# EAGLE design power (EAGLE 9.1.1)

## Sheet 1 of 2: Power supply denoising
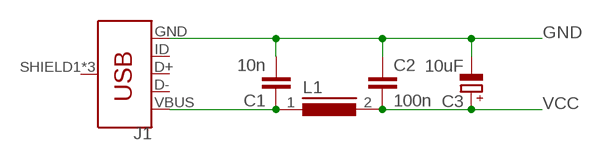
[diagram p0: schematic, sheet 1]

### Parts
C1  10n  C-EU050-024X044  [C050-024X044]
C2  100n  C-EU050-024X044  [C050-024X044]
C3  10uF  CPOL-EUE2.5-5  [E2,5-5]
J1  USB_MICRO-B_FEMALE-SMT  [USB-B-MICRO-SMD]
L1  Ferrite bead  MMICC7  [MMICC7]

### Nets
GND: C1.2 C2.1 C3.- J1.GND ; also sheet 2
VBUS: C1.1 J1.VBUS L1.1
VCC: C2.2 C3.+ L1.2 ; also sheet 2
Unconnected: J1.D+ J1.D- J1.ID J1.SHIELD1(SHIELD) J1.SHIELD2(SHIELD) J1.SHIELD3(SHIELD)

## Sheet 2 of 2: Connectors and op-amp stages
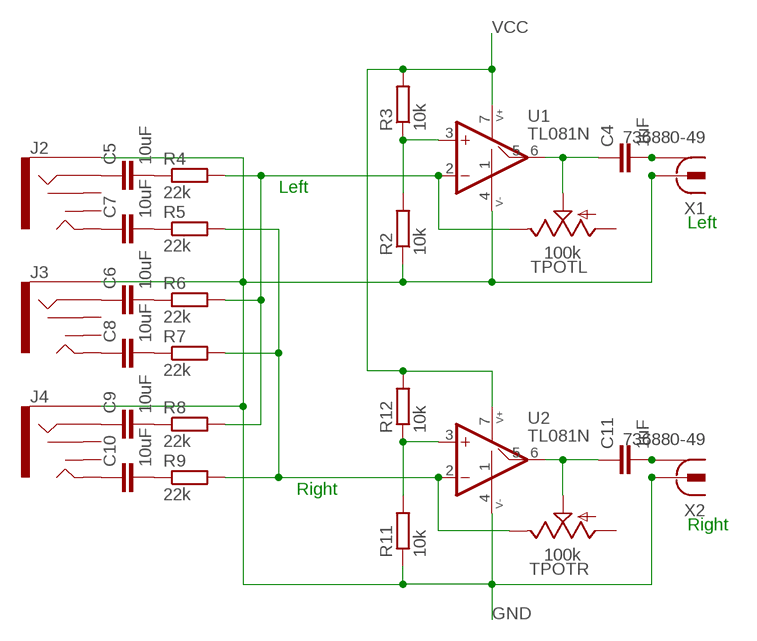
[diagram p1: schematic, sheet 2]

### Parts
C4  1uF  C-EU050-024X044  [C050-024X044]
C5  10uF  C-EU050-024X044  [C050-024X044]
C6  10uF  C-EU050-024X044  [C050-024X044]
C7  10uF  C-EU050-024X044  [C050-024X044]
C8  10uF  C-EU050-024X044  [C050-024X044]
C9  10uF  C-EU050-024X044  [C050-024X044]
C10  10uF  C-EU050-024X044  [C050-024X044]
C11  1uF  C-EU050-024X044  [C050-024X044]
J2  AUDIO_JACK_3.5MM_KIT  [AUDIO-JACK-KIT]
J3  AUDIO_JACK_3.5MM_KIT  [AUDIO-JACK-KIT]
J4  AUDIO_JACK_3.5MM_KIT  [AUDIO-JACK-KIT]
R2  10k  R-EU_0204/5  [0204/5]
R3  10k  R-EU_0204/5  [0204/5]
R4  22k  R-EU_0204/5  [0204/5]
R5  22k  R-EU_0204/5  [0204/5]
R6  22k  R-EU_0204/5  [0204/5]
R7  22k  R-EU_0204/5  [0204/5]
R8  22k  R-EU_0204/5  [0204/5]
R9  22k  R-EU_0204/5  [0204/5]
R11  10k  R-EU_0204/5  [0204/5]
R12  10k  R-EU_0204/5  [0204/5]
TPOTL  100k  TRIM_US-B25P  [B25P]
TPOTR  100k  TRIM_US-B25P  [B25P]
U1  TL081N  [DIL08]
U2  TL081N  [DIL08]
X1  736880-49  [736880-49]
X2  736880-49  [736880-49]

### Nets
GND: J2.SLEEVE J3.SLEEVE J4.SLEEVE R2.1 R11.1 U1.4(P:V-) U2.4(P:V-) X1.2 X2.2 ; also sheet 1
N$4: R4.2 R6.2 R8.2 TPOTL.E U1.2(A:-IN)
N$5: C4.1 TPOTL.S U1.6(A:OUT)
N$6: C4.2 X1.1 X1.1@1 X1.1@2
N$8: C5.1 J2.RING
N$9: R2.2 R3.1 U1.3(A:+IN)
N$10: C6.1 J3.RING
N$12: C7.1 J2.TIP
N$13: C8.1 J3.TIP
N$14: C9.1 J4.RING
N$15: C10.1 J4.TIP
N$16: C5.2 R4.1
N$17: C7.2 R5.1
N$18: C6.2 R6.1
N$19: C8.2 R7.1
N$20: C9.2 R8.1
N$21: C10.2 R9.1
N$24: C11.1 TPOTR.S U2.6(A:OUT)
N$25: C11.2 X2.1 X2.1@1 X2.1@2
N$27: R11.2 R12.1 U2.3(A:+IN)
N$30: R5.2 R7.2 R9.2 TPOTR.E U2.2(A:-IN)
VCC: R3.2 R12.2 U1.7(P:V+) U2.7(P:V+) ; also sheet 1
Unconnected: J2.RSH J2.TSH J3.RSH J3.TSH J4.RSH J4.TSH TPOTL.A TPOTR.A U1.1(-NULL:NULL1) U1.5(-NULL:NULL2) U2.1(-NULL:NULL1) U2.5(-NULL:NULL2)

### Notes on the sheet
- Left
- Left
- Right
- Right

## Library data of the parts
C1 C2 = resistor:C-EU: CAPACITOR, European symbol
C3 = resistor:CPOL-EU: POLARIZED CAPACITOR, European symbol
C4-C11 = rcl:C-EU: CAPACITOR, European symbol; SPICEPREFIX: C
J1 = SparkFun-Connectors:USB_MICRO-B: USB Type Micro-B Connector Male/female and PTH/SMT variants SparkFun Products: SparkFun microB USB Breakout <https://www.sparkfun.com/products/12035> SparkFun USB microB Plug Breakout <https://www.sparkfun.com/products/10031> SparkFun ESP8266 Thing <https://www.sparkfun.com/products/13231>; PROD_ID: CONN-11752
J2-J4 = SparkFun-Connectors:AUDIO_JACK_3.5MM: Audio Jack 3.5mm variants of PTH and SMT stereo audio jack with bypass switches. SparkFun Products: SparkFun SparkPunk Sound Kit <[https://www.sparkfun.com/products/11177]> - PTH MP3 Trigger <https://www.sparkfun.com/products/13720> -3.5mm SMD SparkFun PicoBoard <https://www.sparkfun.com/products/11888>- 2.5mm SMD; PROD_ID: CONN-08774; SF_ID: PRT-08032
L1 = inductors:MMICC7: INDUCTOR; SPICEPREFIX: L
R2-R9 R11 R12 = resistor:R-EU_: RESISTOR, European symbol
TPOTL TPOTR = pot:TRIM_US-: POTENTIOMETER
U1 U2 = op-amp:TL081: JFET OP-AMP
X1 X2 = con-conrad:736880-49: Cinch Connector ( RCA Jack ) Cinch-Einbaukupplung 90º 72345 Vernickelt BKL Electronic Source: Conrad <http://www.conrad.de/ce/de/product/736880>

## Board
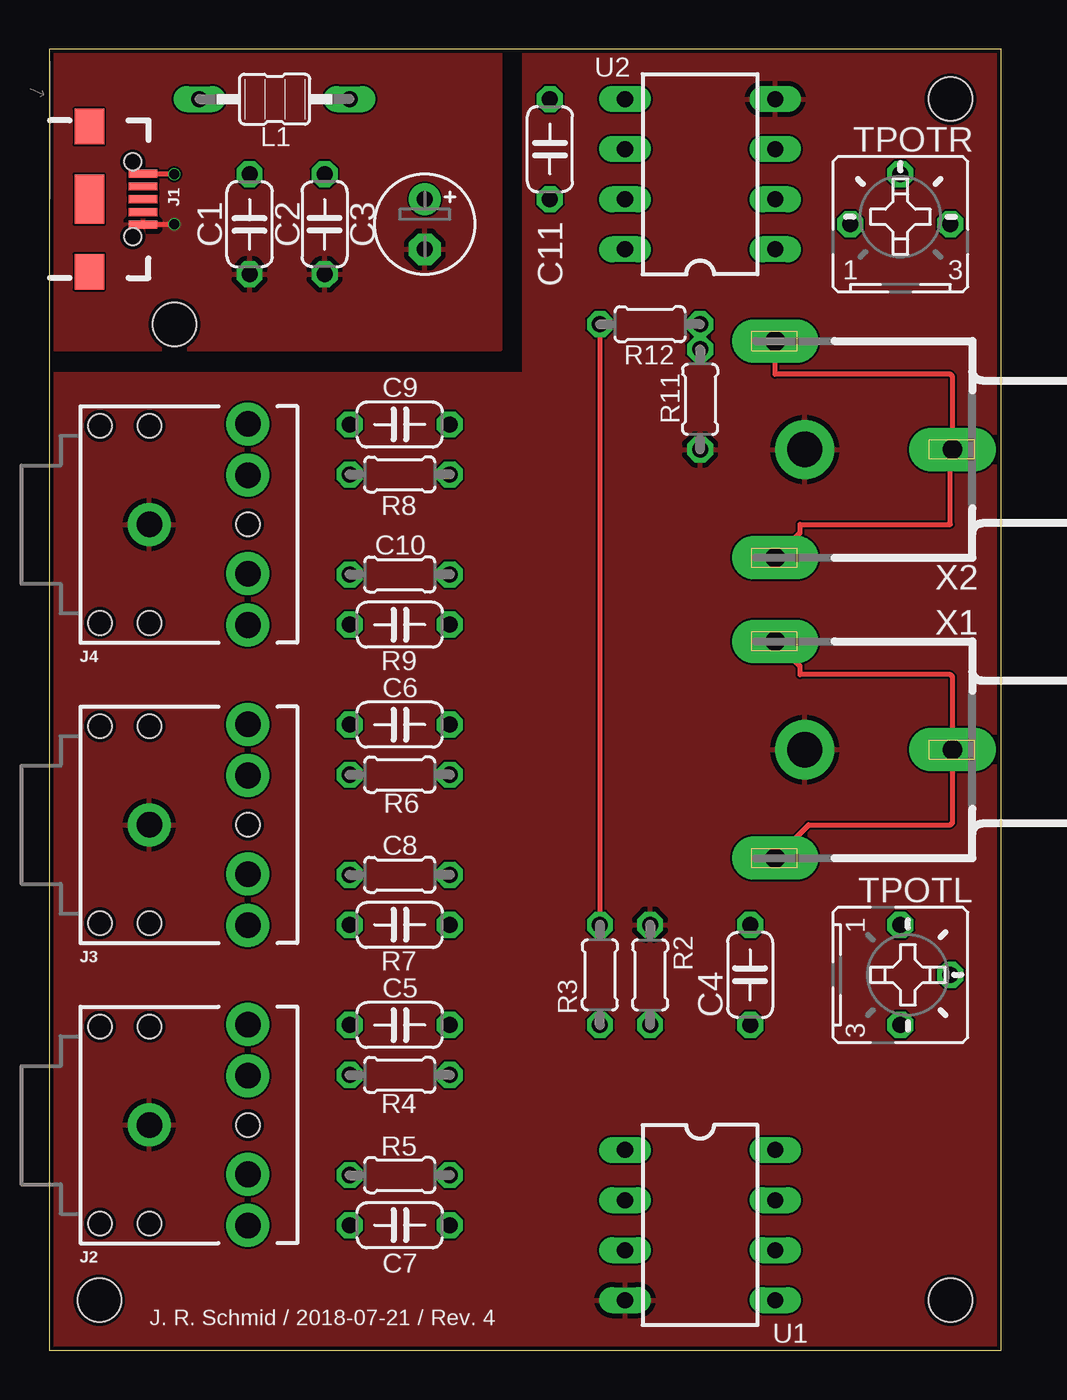
[diagram p2: board, top side]
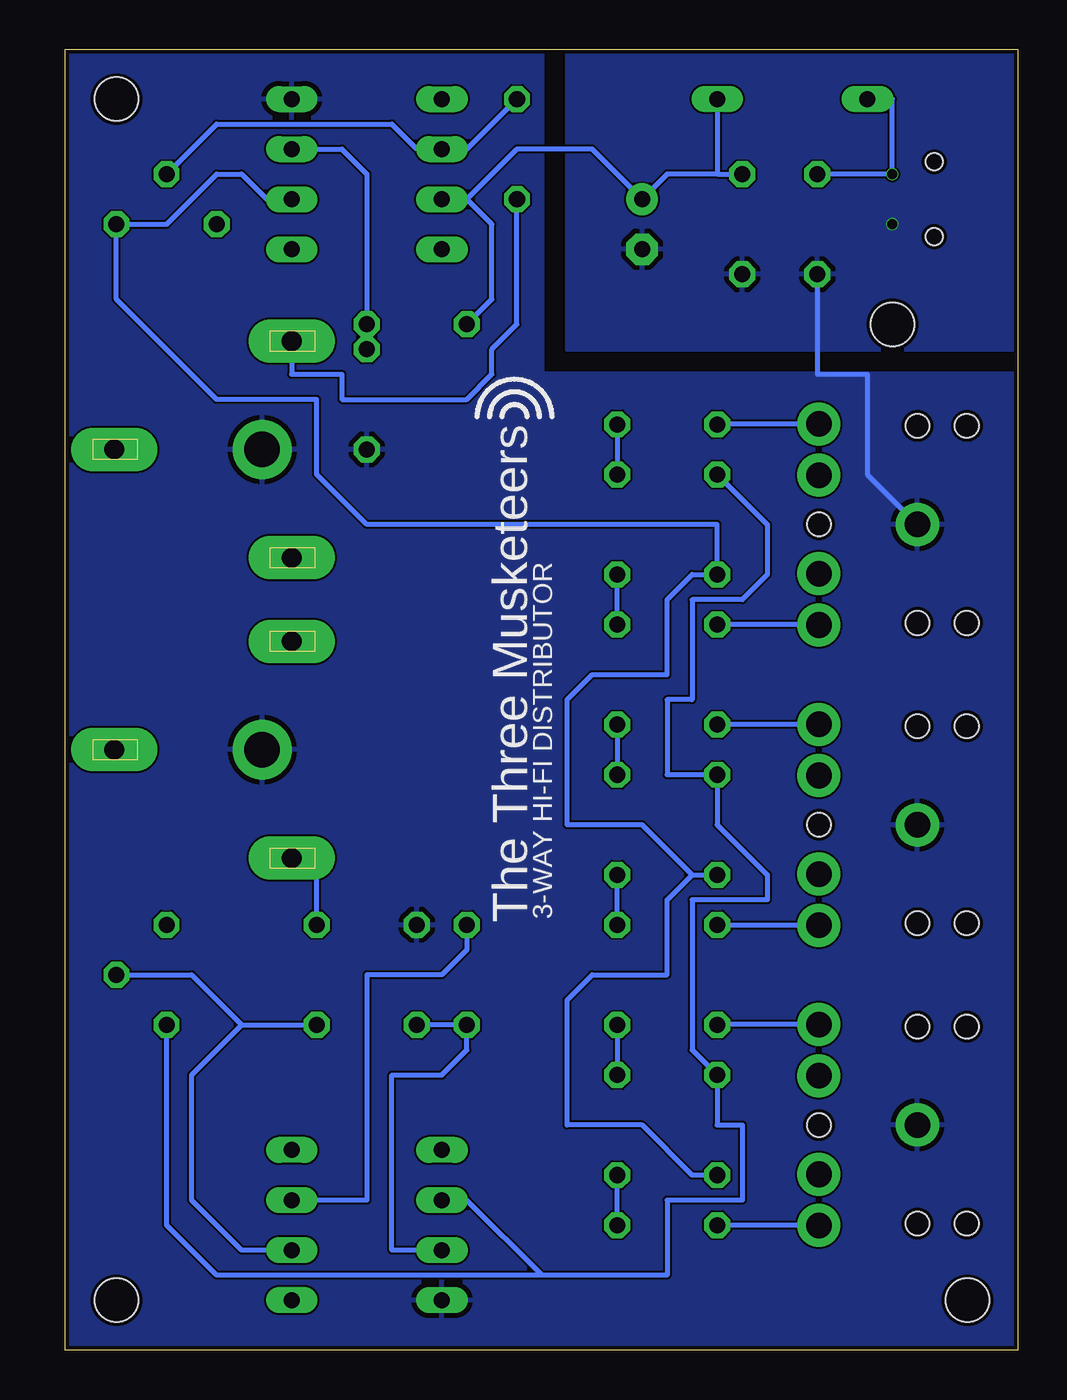
[diagram p3: board, bottom side, seen from below]

Size 48.31 x 66.03 mm. Coordinates in mm from the lower left corner, seen from the top.
Outline: 0,0 48.31,0 48.31,66.03 0,66.03 0,0
Copper layers (1*16): Top 0.035mm / dielectric 1.5mm / Bottom 0.035mm
Design rules "aisler_2_layer": minimum track width 0.1mm, minimum drill 0.2mm, track to track 0.1mm, track to pad 0.1mm, pad to pad 0.1mm, via to via 0.1mm, smd to smd 0.1mm, copper to edge 0.2mm, drill to drill 0.21mm, minimum pad ring 0.25mm, minimum via ring 0.05mm, stop-mask expansion 0mil, vias tented up to drill 0mil, thermal gap 10mil
Holes 2.2 mm at 2.54,2.54 45.72,2.54 45.72,63.5 6.35,52.07

### Footprints (pad centres in the part's own frame; a part is rotated, then mirrored left to right if it is on the bottom)
C050-024X044 = drill 0.813 octagon: 1 -2.54,0; 2 2.54,0
E2,5-5 = drill 0.813 pad 1.6: + -1.27,0 | drill 0.813 pad 1.6 octagon: - 1.27,0
USB-B-MICRO-SMD = smd 1.45 x 0.4: D+ 2.725,0; D- 2.725,0.65; GND 2.725,-1.3; ID 2.725,-0.65; VBUS 2.725,1.3 | smd 1.5 x 1.8: SHIELD1 0,3.685; SHIELD2 0,-3.685 | smd 1.5 x 2.5: SHIELD3 0,0 | hole 0.85: 2.2,1.9; 2.2,-1.9
AUDIO-JACK-KIT = drill 1.3 pad 2.184: RING 5,5.1; RSH 5,2.5; SLEEVE 0,0; TIP 5,-5.1; TSH 5,-2.5 | hole 1.2: 0,5; -2.5,5; -2.5,-5; 0,-5; 5,0
MMICC7 = drill 0.813 long: 1 -3.81,0; 2 3.81,0
0204/5 = drill 0.813 octagon: 1 -2.54,0; 2 2.54,0
B25P = drill 0.813 octagon: A -2.54,0; E 2.54,0; S 0,2.54
DIL08 = drill 0.813 long: 1 -3.81,-3.81; 2 -1.27,-3.81; 3 1.27,-3.81; 4 3.81,-3.81; 5 3.81,3.81; 6 1.27,3.81; 7 -1.27,3.81; 8 -3.81,3.81
736880-49 = drill 1 pad 2.2 long: 1 -3.92,0; 1@1 5.08,-5.5; 1@2 5.08,5.5 | drill 1.8 pad 3: 2 3.58,0

### Placement (x,y rotation side)
C1  10.16,57.15 270 top
C2  13.97,57.15 90 top
C3  19.05,57.15 270 top
C4  35.56,19.05 90 top
C5  17.78,16.51 0 top
C6  17.78,31.75 0 top
C7  17.78,6.35 0 top
C8  17.78,21.59 0 top
C9  17.78,46.99 0 top
C10  17.78,36.83 0 top
C11  25.4,60.96 270 top
J1  2.03,58.42 0 top
J2  5.08,11.43 0 top
J3  5.08,26.67 0 top
J4  5.08,41.91 0 top
L1  11.43,63.5 0 top
R2  30.48,19.05 270 top
R3  27.94,19.05 90 top
R4  17.78,13.97 180 top
R5  17.78,8.89 180 top
R6  17.78,29.21 180 top
R7  17.78,24.13 180 top
R8  17.78,44.45 180 top
R9  17.78,39.37 180 top
R11  33.02,48.26 90 top
R12  30.48,52.07 180 top
TPOTL  43.18,19.05 270 top
TPOTR  43.18,57.15 0 top
U1  33.02,6.35 270 top
U2  33.02,59.69 90 top
X1  41.91,30.48 180 top
X2  41.91,45.72 180 top

### Tracks (layer width: path | path; a pad name or v marks a point on that pad's centre or on a via)
GND  (via drill 0.51)
  Top 0.254: J1.GND 4.79,57.15 v6.35,57.15
  Bottom 0.254: C1.2 10.16,49.53 7.62,49.53 7.62,44.45 J4.SLEEVE
  pour Bottom: 0,66.04 22.86,66.04 22.86,50.8 0,50.8
  pour Top: 22.86,66.04 22.86,50.8 0,50.8 0,66.04
  pour Top: 24.13,66.04 48.26,66.04 48.26,0 0,0 0,49.53 24.13,49.53
  pour Bottom: 24.13,66.04 48.26,66.04 48.26,0 0,0 0,49.53 24.13,49.53
N$4
  Bottom 0.254: R8.2 12.7,41.91 12.7,39.37 13.97,38.1 16.51,38.1 16.51,33.02 17.78,33.02 17.78,29.21 R6.2 15.24,26.67 12.7,24.13 12.7,22.86 16.51,22.86 16.51,15.24 R4.2 15.24,11.43 13.97,11.43 13.97,7.62 17.78,7.62 17.78,3.81 24.13,3.81 | 24.13,3.81 27.94,7.62 U1.2 | 24.13,3.81 40.64,3.81 43.18,6.35 TPOTL.E
N$5
  Bottom 0.254: U1.6 39.37,5.08 41.91,7.62 41.91,13.97 39.37,16.51 | 39.37,16.51 C4.1 | TPOTL.S 41.91,19.05 39.37,16.51
N$6
  Top 0.254: X1.1@2 38.52,26.67 45.72,26.67 45.83,26.78 X1.1 45.83,34.18 45.72,34.29 38.1,34.29 38.1,34.71 X1.1@1
  Bottom 0.254: C4.2 35.56,24.13 35.98,24.13 X1.1@2
N$8
  Bottom 0.254: J2.RING 15.22,16.53 C5.1
N$9
  Bottom 0.254: U1.3 31.75,5.08 31.75,13.97 29.21,13.97 27.94,15.24 R3.1 R2.2
N$10
  Bottom 0.254: J3.RING 10.1,31.75 C6.1
N$12
  Bottom 0.254: J2.TIP 15.22,6.33 C7.1
N$13
  Bottom 0.254: J3.TIP 15.22,21.57 C8.1
N$14
  Bottom 0.254: J4.RING 15.22,47.01 C9.1
N$15
  Bottom 0.254: J4.TIP 10.1,36.83 C10.1
N$16
  Bottom 0.254: C5.2 R4.1
N$17
  Bottom 0.254: C7.2 R5.1
N$18
  Bottom 0.254: C6.2 R6.1
N$19
  Bottom 0.254: C8.2 R7.1
N$20
  Bottom 0.254: C9.2 R8.1
N$21
  Bottom 0.254: C10.2 R9.1
N$24
  Bottom 0.254: TPOTR.S 40.64,62.23 31.75,62.23 30.48,60.96 U2.6 27.94,60.96 C11.1
N$25
  Top 0.254: X2.1@2 38.1,41.49 38.1,41.91 45.72,41.91 45.72,45.61 X2.1 45.83,49.42 45.72,49.53 36.83,49.53 X2.1@1
  Bottom 0.254: X2.1@1 36.83,49.53 34.29,49.53 34.29,48.26 27.94,48.26 26.67,49.53 26.67,50.8 25.4,52.07 C11.2
N$27
  Bottom 0.254: R11.2 R12.1 33.02,59.69 34.29,60.96 U2.3
N$30
  Bottom 0.254: 16.51,24.13 R7.2 | U2.2 38.1,58.42 39.37,59.69 40.64,59.69 43.18,57.15 TPOTR.E 45.72,53.34 40.64,48.26 35.56,48.26 35.56,44.45 33.02,41.91 15.24,41.91 R9.2 16.51,39.37 17.78,38.1 17.78,34.29 21.59,34.29 22.86,33.02 22.86,26.67 19.05,26.67 16.51,24.13 | R5.2 16.51,8.89 19.05,11.43 22.86,11.43 22.86,17.78 21.59,19.05 17.78,19.05 17.78,22.86 16.51,24.13
VBUS  (via drill 0.51)
  Top 0.254: J1.VBUS 6.32,59.72 v6.35,59.69
  Bottom 0.254: L1.1 6.35,63.5 v6.35,59.69 C1.1
VCC
  Top 0.254: R12.2 R3.2
  Bottom 0.254: L1.2 15.24,59.69 | 15.24,59.69 C2.2 | 15.24,59.69 17.78,59.69 C3.+ 21.59,60.96 25.4,60.96 27.94,58.42 | U2.7 27.94,58.42 | R12.2 26.67,53.34 26.67,57.15 27.94,58.42 | R3.2 27.94,20.32 29.21,19.05 33.02,19.05 33.02,7.62 U1.7

### Text on the board
tPlace: J. R. Schmid / 2018-07-21 / Rev. 4
bPlace: The Three Musketeers | 3-WAY HI-FI DISTRIBUTOR